# Altium schematic sheet Supply.SchDoc
size A4; DocumentNumber: 11; SheetNumber: 11; SheetTotal: 11
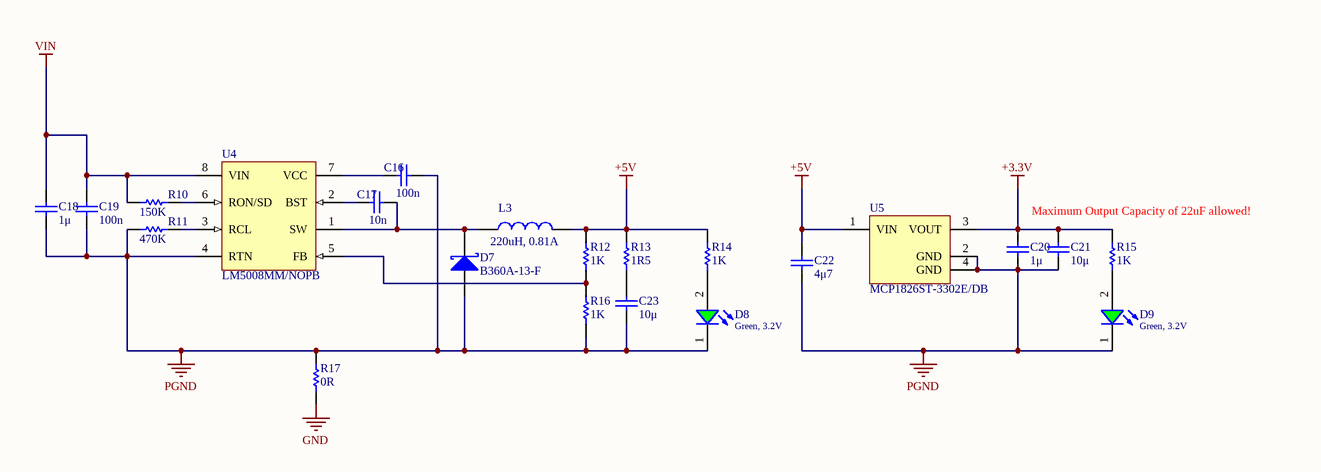
[diagram p0: Supply.SchDoc]

## Parts
C16  100n  [CAPC0603(1608)55_N]
C17  10n  [CAPC0603(1608)55_N]
C18  1μ  [CAPC0603(1608)55_N]
C19  100n  [CAPC0603(1608)55_N]
C20  1μ  [CAPC0603(1608)55_N]
C21  10μ  [CAPC0603(1608)55_N]
C22  4μ7  [CAPC0603(1608)55_N]
C23  10μ  [CAPC0603(1608)55_N]
D7  B360A-13-F  [DIOD-B360A_V]
D8  Green, 3.2V  [WL-SMCW_0603_H=0.25mm]
D9  Green, 3.2V  [WL-SMCW_0603_H=0.25mm]
L3  220uH, 0.81A  [WE-LQS_8040]
R10  150K  [RESC0603(1608)_N]
R11  470K  [RESC0603(1608)_N]
R12  1K  [RESC0603(1608)_N]
R13  1R5  [RESC0603(1608)_N]
R14  1K  [RESC0603(1608)_N]
R15  1K  [RESC0603(1608)_N]
R16  1K  [RESC0603(1608)_N]
R17  0R  [RESC0603(1608)_N]
U4  LM5008MM/NOPB  [DGK0008A_M]
U5  MCP1826ST-3302E/DB  [SOT-223-DB3_M]

## Nets
+3.3V: C20.2 C21.2 R15.2 U5.3(VOUT)
+5V: C22.2 L3.2 R12.2 R13.2 R14.2 U5.1(VIN)
GND: R17.1
PGND: C16.1 C18.1 C19.1 C20.1 C21.1 C22.1 C23.1 D7.1(A) D8.1(K) D9.1(K) R11.1 R16.1 R17.2 U4.4(RTN) U5.2(GND) U5.4(GND)
VIN: C18.2 C19.2 R10.1 U4.8(VIN)
NetC16_2: C16.2 U4.7(VCC)
NetC17_1: C17.1 U4.2(BST)
NetC17_2: C17.2 D7.2(K) L3.1 U4.1(SW)
NetC23_2: C23.2 R13.1
NetD8_2: D8.2(A) R14.1
NetD9_2: D9.2(A) R15.1
NetR10_2: R10.2 U4.6(RON/SD)
NetR11_2: R11.2 U4.3(RCL)
NetR12_1: R12.1 R16.2 U4.5(FB)

## Notes on the sheet
- Maximum Output Capacity of 22uF allowed!

## Library data of the parts
C16 C19 = Cap 100n: Keramikvielschichtkondensator, SMD, Baureihe MC, ± 10%; Manufacturer: TDK; Voltage Rating: 50V; OC_MOUSER: CGA3E2X7R1H104K080AA; Value: 100n; PackageReference: 0603; Tolerance: ± 10%
C17 = Cap 10n: Keramikvielschichtkondensator, SMD, Baureihe MC, ± 10%; Manufacturer: TDK; Voltage Rating: 50V; OC_MOUSER: CGA3E2X7R1H103K080AA; Value: 10n; PackageReference: 0603; Tolerance: ± 10%
C18 C20 = Cap 1μ: Keramikvielschichtkondensator, SMD, Baureihe MC, ± 10%; Manufacturer: TDK; Voltage Rating: 50V; OC_MOUSER: CGA3E3X5R1H105K080AB; Value: 1μ; PackageReference: 0603; Tolerance: ± 10%
C21 C23 = Cap 10μ: Keramikvielschichtkondensator, SMD, Baureihe MC, ± 10%; Manufacturer: TDK; Voltage Rating: 6.3V; OC_MOUSER: C1608X5R0J106K080AB; Value: 10μ; PackageReference: 0603; Tolerance: ± 10%
C22 = Cap 4μ7: Keramikvielschichtkondensator, SMD, Baureihe MC, ± 10%; Manufacturer: TDK; Voltage Rating: 6.3V; OC_MOUSER: CGA3E1X5R0J475K080AC; Value: 4μ7; PackageReference: 0603; Tolerance: ± 10%
D7 = CMP-2000-05898-1: Schottky Barrier Rectifier, 3 A, -55 to 150 degC, 2-Pin Molded, RoHS, Tape and Reel; Manufacturer: DiodesIncorporated; Vf - Forward Voltage: 0.7V; Ifsm - Forward Surge Current: 80A; If - Forward Current: 3A; Unit Weight: 0.002258oz; Ir - Reverse Current: 500uA; Vrrm - Repetitive Reverse Voltage: 60V; Configuration: Single; Length: 4.6mm; Datasheet Version: Rev. 15-2, 09/2014; Technology: Si; Factory Pack Quantity: 5000; Manufacturer URL: http://www.diodes.com/; Type: SchottkyBarrierRectifier; Product Category: SchottkyDiodes&Rectifiers; Minimum Operating Temperature: -55C; Packaging: Reel; Product: SchottkyDiodes; Height: 2.3mm; Datasheet URL: https://datasheet.ciiva.com/914/ds30891-914080.pdf; Series: B360; Brand: DiodesIncorporated; Maximum Operating Temperature: +125C; Termination Style: SMD/SMT; Package / Case: SMA; Mounting Style: SMD/SMT; RoHS: True; Package Description: 2-Pin Surface Mount Device, Body 4.3 x 2.605 mm; Operating Temperature Range: -55Cto+125C; Package Reference: B360A; Width: 2.92mm; Mounting Technology: SurfaceMount
D8 D9 = 150060GS75020: WL-SMCW SMT Mono-color Chip LED Waterclear, size 0603, Green, 3.2V, 140deg; Chip Technology: InGaN; Dominant Wavelength typ.: 525nm; Luminous Intensity typ.: 700mcd; Peak Wavelength typ.: 515nm; Viewing Angle: 140deg; ComponentLink1Description: Manufacturer; ComponentLink1URL: http://www.we-online.de; ComponentLink2URL: https://www.we-online.com/catalog/datasheet/150060GS75020.pdf; ComponentLink2Description: Datasheet; Forward Voltage typ.: 3.2V; Emitting Color: Green; Mounting Technology: SMT; Operating Temperature: -40 to +85degC; Published Date: March 2020; Part Number: 150060GS75020; Packaging: Tape and Reel; Size: 0603; Publisher: Wurth Elektronik
L3 = 1: WE-LQS SMT Power Inductor, size 8040, 220uH, 0.81A; Manufacturer: Wurth Elektronik; Saturation Current: 1.1A; Self Resonant Frequency: 4.5MHz; DC Resistance: 592mOhm; ComponentLink1Description: Manufacturer; ComponentLink1URL: http://www.we-online.de; ComponentLink2Description: Datasheet; ComponentLink2URL: https://www.we-online.com/catalog/datasheet/74404084221.pdf; Published Date: March 2020; Rated Current: 0.81A; Operating Temperature: -40 to +125degC; Mounting Technology: SMT; Packaging: Tape and Reel; Manufacturer Part Number: 74404084221; Inductance: 220uH; Size: 8040
R10 = Res 150K: Chipwiderstand, SMD, Baureihe MC, 1%; Manufacturer: Multicomp; Power: 100mW; PackageReference: 0603; Value: 150K; OC_FARNELL: 9331824
R11 = Res 470K: Chipwiderstand, SMD, Baureihe MC, 1%; Manufacturer: Multicomp; Power: 100mW; PackageReference: 0603; Value: 470K; OC_FARNELL: 9331263
R12 R14-R16 = Res 1K: Chipwiderstand, SMD, Baureihe MC, 1%; Manufacturer: Multicomp; Power: 100mW; PackageReference: 0603; Value: 1K; OC_FARNELL: 9330380
R13 = Res 1R5: Chipwiderstand, SMD, Baureihe MC, 1%; Manufacturer: Multicomp; Power: 100mW; PackageReference: 0603; Value: 1R5; OC_FARNELL: 2447290
R17 = Res 0R: Chipwiderstand, SMD, Baureihe MC, 1%; Manufacturer: Multicomp; Power: 100mW; PackageReference: 0603; Value: 0R; OC_FARNELL: 9331662
U4 = CMP-0069-01345-3: High Voltage (100V) Step Down Switching Regulator, 8-pin MSOP, Pb-Free; Manufacturer: Texas Instruments; PackageTopMarking: ZXTT*SAYB; CompType: Switcher; PowerWise: N; RoHS: Y; PinCount: 8; ComponentLink1URL: http://www.ti.com/general/docs/lit/getliterature.tsp?genericPartNumber=LM5008&fileType=pdf; ComponentLink1Description: Datasheet URL; Code_JEDEC: MO-187-AA; PackageDescription: MINI SOIC, .118 x .118 x .034in, 8 Lead, .0256in Pitch; PackageReference: DGK0008A
U5 = CMP-0136-00497-1: 1000 mA, Low Voltage, Low Quiescent Current LDO Regulator, 3-Pin SOT-223, Extended Temperature, Tape and Reel; PackageVersion: revBB, Aug-2009; PackageDescription: 3-Lead Plastic Small Outline Transistor (DB) [SOT-223]; DatasheetVersion: revA, Aug-2007; PackageReference: SOT-223-DB3